# EAGLE design 224_distance_2m (EAGLE 9.6.0)
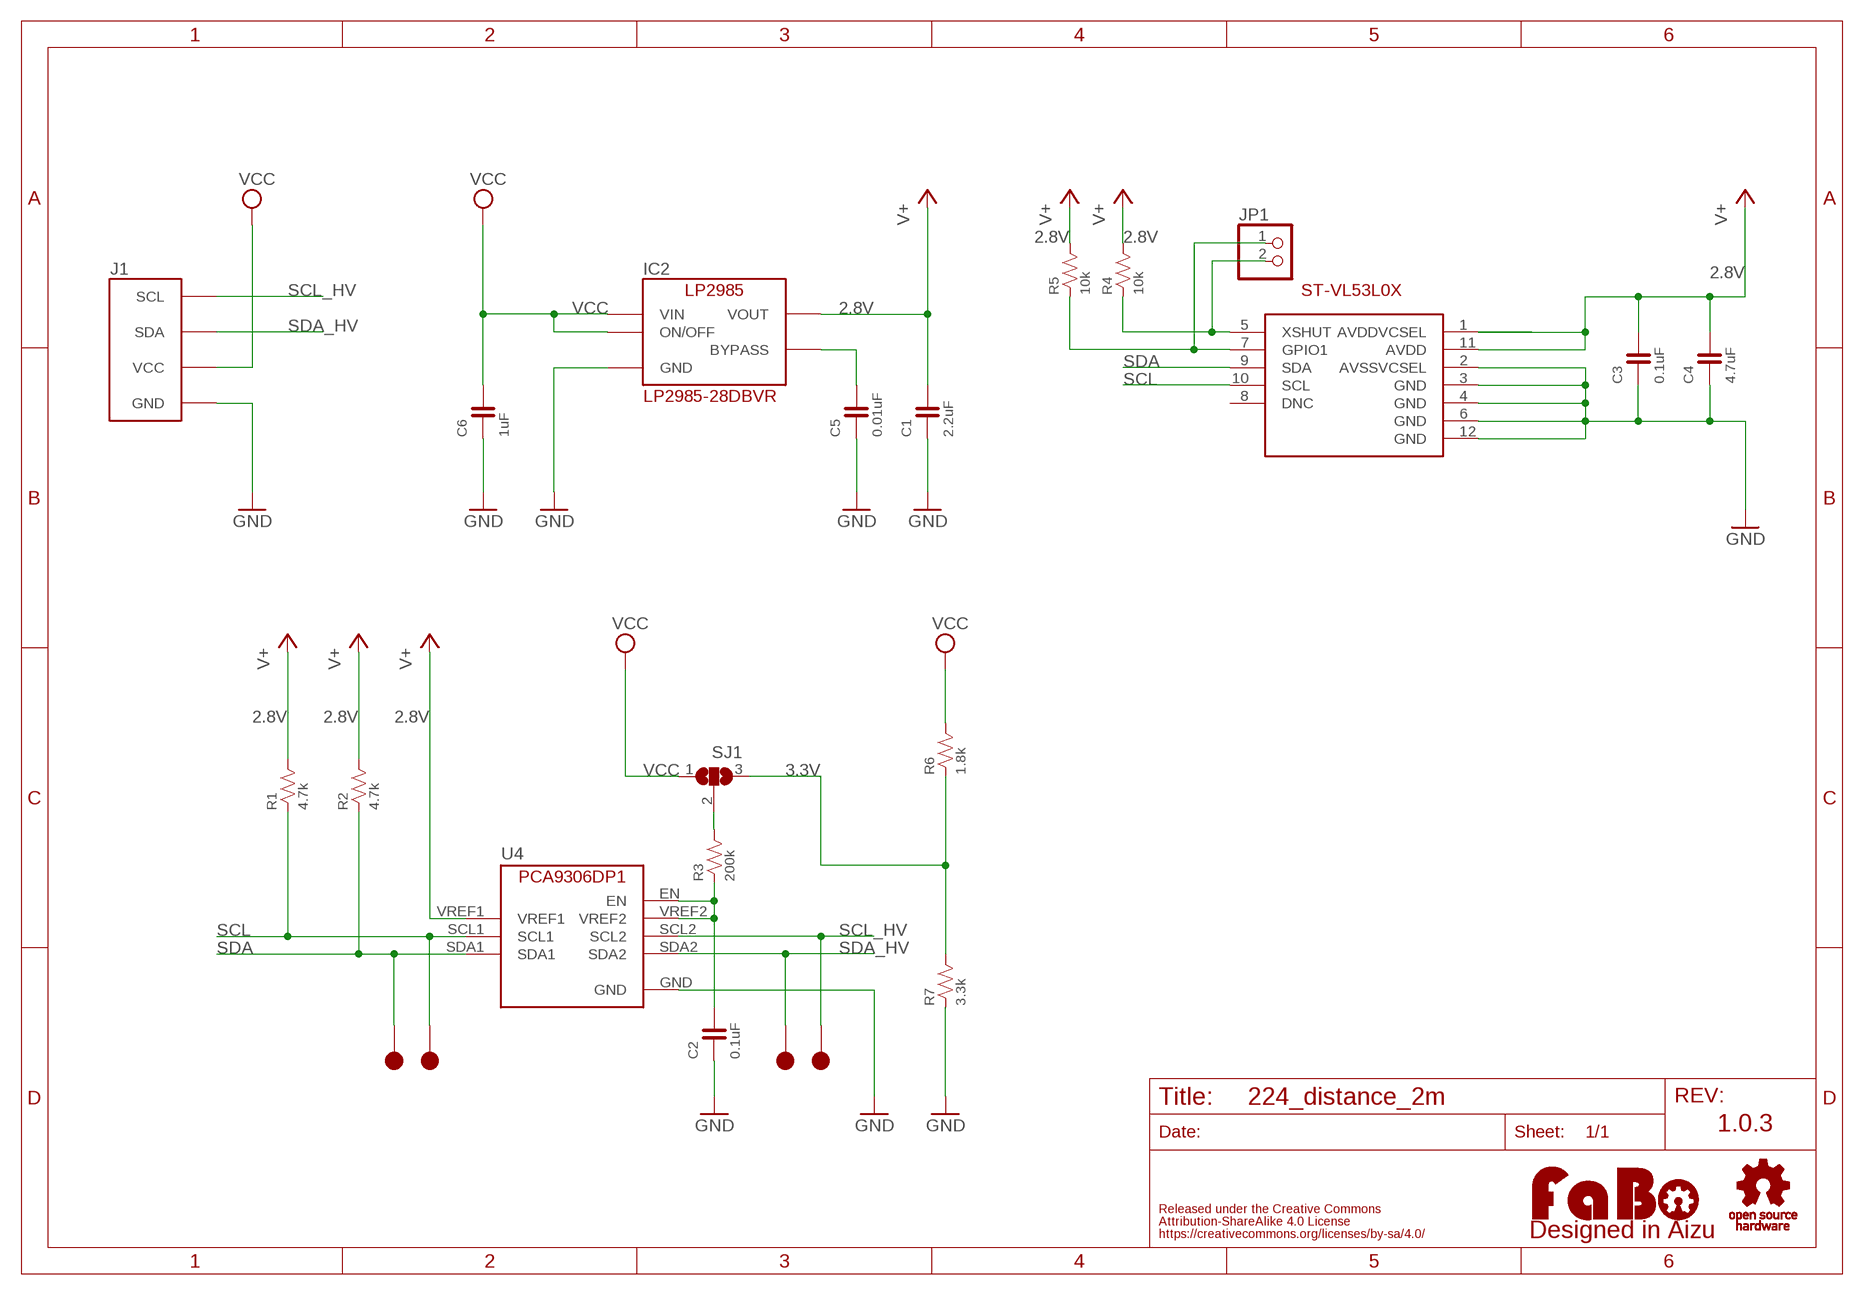
[diagram p0: schematic, sheet 1]

## Parts
C1  2.2uF  CAPACITOR-0603  [0603]
C2  0.1uF  CAPACITOR-0603  [0603]
C3  0.1uF  CAPACITOR-0603  [0603]
C4  4.7uF  CAPACITOR-0603  [0603]
C5  0.01uF  CAPACITOR-0603  [0603]
C6  1uF  CAPACITOR-0603  [0603]
IC2  LP2985-33DBV  [SOT-23-5]
J1  FABO_BRICK_I2C  [FABO_BRICK_I2C]
JP1  PINHD-1X2  [1X02]
LOGO1  LOGO_FABO-M  [LOGO_FABO_M]
R1  4.7k  RESISTOR-0603  [0603]
R2  4.7k  RESISTOR-0603  [0603]
R3  200k  RESISTOR-0603  [0603]
R4  10k  RESISTOR-0603  [0603]
R5  10k  RESISTOR-0603  [0603]
R6  1.8k  RESISTOR-0603  [0603]
R7  3.3k  RESISTOR-0603  [0603]
SJ1  SJ2W  [SJ_2]
TP1  TP-15  [TP-15]
TP2  TP-15  [TP-15]
TP3  TP-15  [TP-15]
TP4  TP-15  [TP-15]
U4  PCA9306DP1  [TSSOP8]
U$2  LOGO_OSHW-M_BOTTOM  [LOGO_OSHW_M_BOTTOM]
VL1  ST-VL53L0XVL53  [ST-VL53L0X]

## Nets
2.8V: C1.2 C3.2 C4.2 IC2.5(VOUT) R1.2 R2.2 R4.2 R5.2 U4.VREF1 VL1.1(AVDDVCSEL) VL1.11(AVDD) ; supply symbol labelled V+
3.3V: R6.1 R7.2 SJ1.3
GND: C1.1 C2.1 C3.1 C4.1 C5.1 C6.1 IC2.2(GND) J1.GND R7.1 U4.GND VL1.2(AVSSVCSEL) VL1.3(GND) VL1.4(GND) VL1.6(GND) VL1.12(GND)
N$1: C2.2 R3.1 U4.EN U4.VREF2
N$2: R3.2 SJ1.2
N$3: C5.2 IC2.4(BYPASS)
N$5: JP1.2 R4.1 VL1.5(XSHUT)
N$6: JP1.1 R5.1 VL1.7(GPIO1)
SCL: R1.1 TP2.1 U4.SCL1 VL1.10(SCL)
SCL_HV: J1.SCL TP4.1 U4.SCL2
SDA: R2.1 TP1.1 U4.SDA1 VL1.9(SDA)
SDA_HV: J1.SDA TP3.1 U4.SDA2
VCC: C6.2 IC2.1(VIN) IC2.3(ON/OFF) J1.VCC R6.2 SJ1.1
Unconnected: VL1.8(DNC)

## Notes on the sheet
- ST-VL53L0X
- LP2985-28DBVR
- 1.0.3

## Library data of the parts
C1-C6 = FaBo-Capacitor:CAPACITOR: CAPACITOR
IC2 = FaBo-Supply:LP2985: LP2985
J1 = FaBo-Template:FABO_BRICK_I2C: FaBo Brick I2C
JP1 = pinhead:PINHD-1X2: PIN HEADER; SPICEPREFIX: B
LOGO1 = component:LOGO_FABO
R1-R7 = FaBo-Resistors:RESISTOR: RESISTOR
SJ1 = jumper:SJ2W: SMD solder JUMPER
TP1-TP4 = FaBo-Supply:TP
U4 = FaBo-LevelTranslator:PCA9306DP1
U$2 = FaBo-etc:LOGO_OSHW
VL1 = FaBo-Mems:ST-VL53L0X

## Board
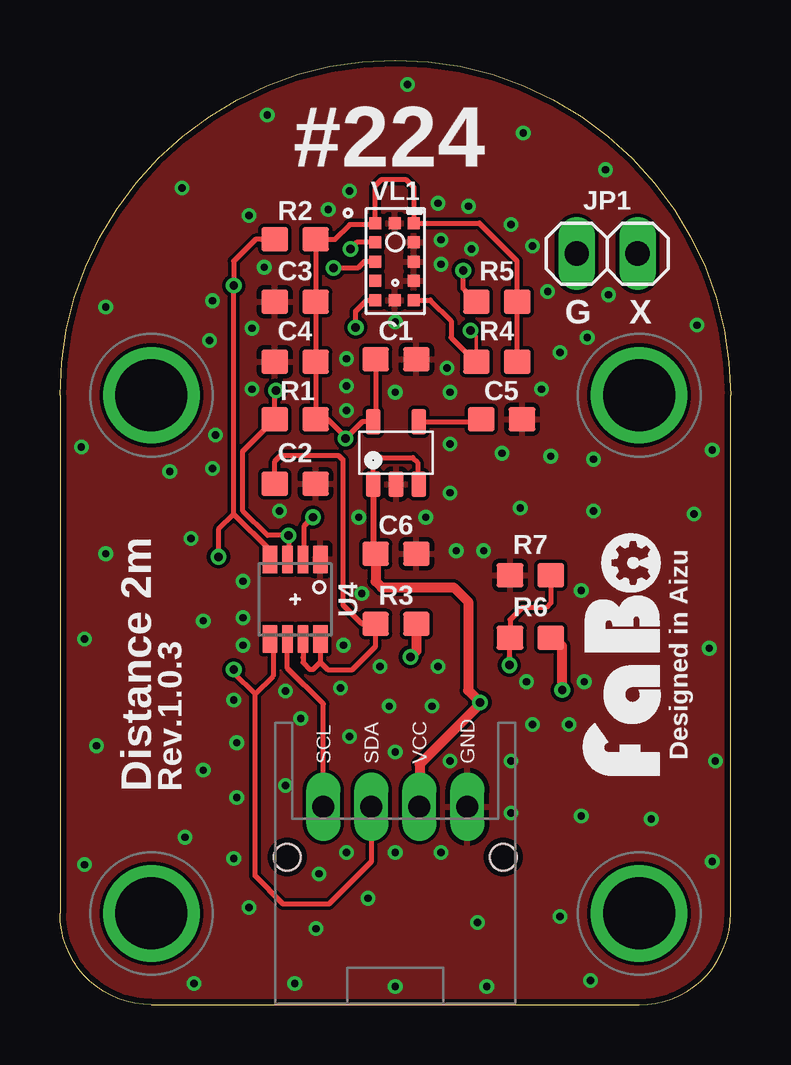
[diagram p1: board, top side]
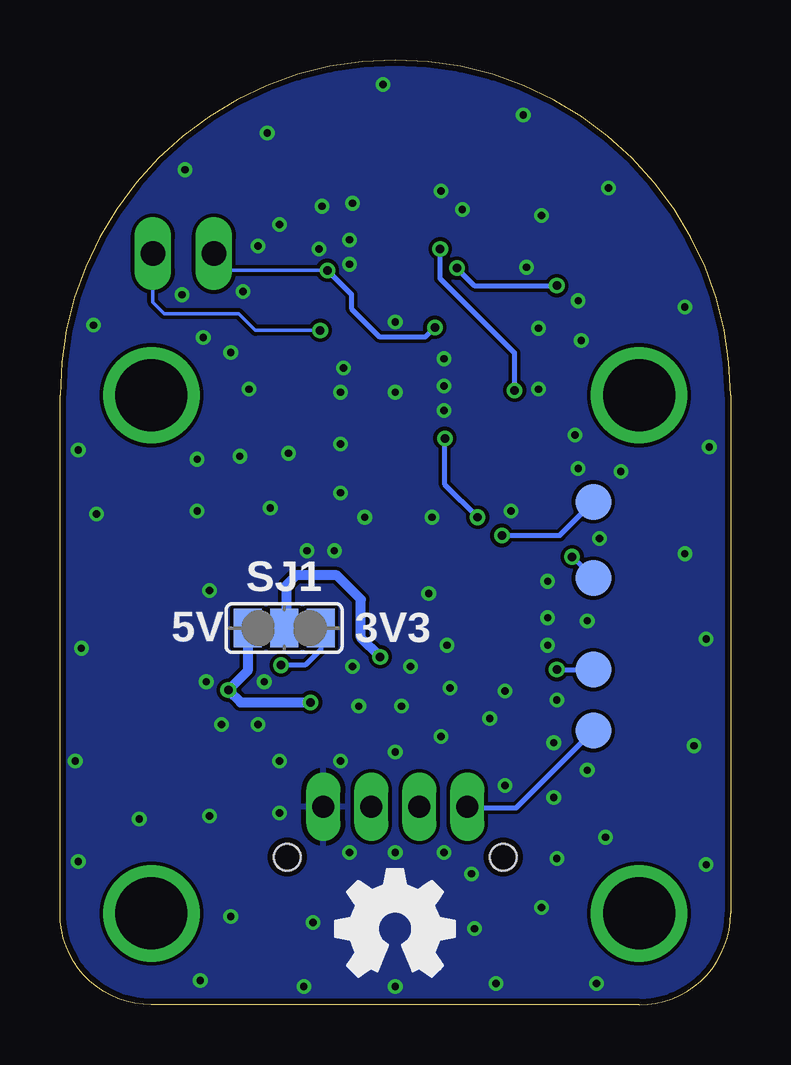
[diagram p2: board, bottom side, seen from below]

Size 27.94 x 39.37 mm. Coordinates in mm from the lower left corner, seen from the top.
Copper layers (1*16): Top 0.035mm / dielectric 1.6mm / Bottom 0.035mm
Design rules "PCBway": minimum track width 6mil, minimum drill 12mil, track to track 6mil, track to pad 6mil, pad to pad 6mil, via to via 6mil, smd to smd 6mil, copper to edge 10mil, drill to drill 10mil, minimum pad ring 10mil, minimum via ring 6mil, stop-mask expansion 2mil, vias tented up to drill 100mil, thermal gap 8mil

### Footprints (pad centres in the part's own frame; a part is rotated, then mirrored left to right if it is on the bottom)
0603 = smd 1.1 x 1: 1 -0.85,0; 2 0.85,0
SOT-23-5 = smd 0.6 x 1.05: 1 -0.95,-1.3; 2 0,-1.3; 3 0.95,-1.3; 4 0.95,1.3; 5 -0.95,1.3
FABO_BRICK_I2C = drill 0.9 pad 1.422 long: GND 3,-10.795; SCL -3,-10.795; SDA -1,-10.795; VCC 1,-10.795 | drill 3 pad 3.81: P$1 -10.16,6.35; P$2 10.16,6.35; P$3 -10.16,-15.24; P$4 10.16,-15.24 | hole 1.1: -4.5,-12.895; 4.5,-12.895
1X02 = drill 1.016 long: 1 -1.27,0; 2 1.27,0
SJ_2 = smd 1.168 x 1.6: 1 -1.524,0; 2 0,0; 3 1.524,0
TP-15 = smd 1.5 x 1.5: 1 0,0
TSSOP8 = smd 0.6 x 1.15: EN -1.05,1.663; GND -1.05,-1.663; SDA1 1.05,-1.663; SDA2 1.05,1.663 | smd 0.45 x 1.15: SCL1 0.325,-1.663; SCL2 0.325,1.663; VREF1 -0.325,-1.663; VREF2 -0.325,1.663
ST-VL53L0X = smd 0.5 x 0.5: 1 0.77,1.58; 2 0.77,0.78; 3 0.77,-0.02; 4 0.77,-0.82; 5 0.77,-1.62; 6 -0.03,-1.62; 7 -0.83,-1.62; 8 -0.83,-0.82; 9 -0.83,-0.02; 10 -0.83,0.78; 11 -0.83,1.58; 12 -0.03,1.58

### Placement (x,y rotation side)
C1  14,26.9 180 top
C2  9.8,21.71 180 top
C3  9.8,29.3 0 top
C4  9.8,26.8 0 top
C5  18.4,24.4 180 top
C6  14,18.8 180 top
IC2  14,23 0 top
J1  13.97,19.05 0 top
JP1  22.8,31.3 0 top
LOGO1  25.4,14.61 90 top
R1  9.8,24.4 0 top
R2  9.8,31.9 0 top
R3  14,15.88 0 top
R4  18.2,26.8 0 top
R5  18.2,29.3 0 top
R6  19.6,15.3 0 top
R7  19.6,17.9 0 top
SJ1  18.6,15.7 0 bottom
TP1  5.71,17.78 0 bottom
TP2  5.71,20.95 0 bottom
TP3  5.71,13.97 0 bottom
TP4  5.71,11.43 0 bottom
U4  9.8,16.9 180 top
U$2  13.97,3.17 0 top
VL1  13.97,30.99 0 top

### Tracks (layer width: path | path; a pad name or v marks a point on that pad's centre or on a via)
2.8V  (via drill 0.35)
  Top 0.152: VL1.11 13.08,32.51
  Top 0.2: 12.06,32.51 11.45,31.9 R2.2 C3.2 C4.2 R1.2 | IC2.5 12.95,24.4 13.15,24.6 C1.2
  Top 0.203: 13.08,32.51 12.06,32.51 | VL1.11 13.14,34.14 13.4,34.4 14.4,34.4 14.74,34.06 VL1.1 17.47,32.57 19.05,30.99 R5.2 R4.2 | U4.VREF1 10.16,18.6 10.16,19.94 v10.54,20.32 | IC2.5 12.6,24.3 11.93,23.63 | 11.93,23.63 v11.9,23.6 | R1.2 11.16,24.4 11.93,23.63
  Bottom 0.203: v10.54,20.32 11.9,21.68 v11.9,23.6
3.3V  (via drill 0.35)
  Top 0.203: R7.2 20.45,16.75 20.25,16.55 19.25,16.55 18.75,16.05 R6.1 18.73,15.28 v18.73,14.15
  Bottom 0.203: SJ1.3 17.08,14.8 17.73,14.15 v18.73,14.15
GND  (via drill 0.3)
  other vias: 13.97,28.45 15.88,31.88 15.88,30.86 17.14,31.5 15.75,33.4 17.02,33.27 18.8,32.51 20.32,29.72 19.68,31.62 12.06,33.91 11.18,33.15 8.51,30.73 11.94,26.92 11.94,24.77 11.94,25.78 13.97,25.53 16.26,25.53 16.13,26.54 20.07,25.65 20.83,27.18 22.86,29.59 21.97,27.81 7.87,32.89 6.35,29.34 8,28.19 8,25.65 6.48,23.75 16.26,23.37 18.41,22.99 20.45,22.86 22.23,22.73 15.24,20.32 16.26,21.34 6.35,22.35 6.22,27.69 12.45,20.32 12.57,17.14 7.62,17.65 7.62,16.13 5.97,16 5.46,19.43 4.57,22.23 9.14,20.57 11.81,14.99 13.34,14.1 15.75,14.1 16.51,18.92 17.65,18.92 19.18,20.7 22.23,20.57 21.72,17.27 19.43,13.46 19.68,11.68 21.84,13.46 21.21,11.68 18.8,8 18.8,10.16 16.26,10.16 15.49,12.45 11.68,13.21 9.4,13.08 10.03,11.94 12.06,11.18 13.97,10.54 13.72,12.45 7.62,14.99 7.24,12.7 7.37,10.92 9.4,9.14 7.37,8.64 5.97,9.78 7.24,6.1 5.21,6.99 11.94,6.35 10.79,5.46 13.97,6.35 15.88,6.35 7.87,4.06 10.67,3.17 12.83,4.45 20.83,3.68 22.1,1.02 13.97,0.76 17.78,0.76 9.78,0.89 5.59,0.89 1.02,5.84 27.18,5.97 21.72,7.87 24.64,7.75 17.4,3.43 1.02,15.24 27.05,14.86 27.3,10.16 1.52,10.79 0.89,23.24 27.18,23.11 26.42,20.45 1.91,18.8 26.54,28.32 1.91,29.08 5.08,34.04 14.48,38.35 22.73,34.8 19.3,36.32 8.64,37.08
  pour Bottom (isolate 0.152): 0,0 27.94,0 27.94,39.37 0,39.37
  pour Top (isolate 0.152): 0,0 27.94,0 27.94,39.37 0,39.37
N$1
  Top 0.2: U4.VREF2 10.12,14.48 | 13.15,14.94 R3.1 | U4.EN 10.85,14.48
  Top 0.203: C2.2 8.95,22.65 9.2,22.9 11.6,22.9 11.8,22.7 11.8,16.65 12.58,15.88 R3.1 | 10.12,14.48 10.12,14.26 10.41,13.97 10.54,13.97 10.85,14.28 | 10.85,14.48 10.85,14.28 | 10.85,14.28 11.16,13.97 12.18,13.97 13.15,14.94
N$2  (via drill 0.35)
  Top 0.406: R3.2 14.85,14.75 v14.6,14.5
  Bottom 0.152: SJ1.2 18.5,15.8
  Bottom 0.406: v14.6,14.5 15.4,15.3 15.4,16.9 16.4,17.9 18.1,17.9 18.5,17.5 18.5,15.8
N$3
  Top 0.2: IC2.4 17.45,24.3 C5.2
N$5  (via drill 0.35)
  Top 0.152: R4.1 17.35,27.85 v17.1,28.1
  Top 0.203: VL1.5 15.43,29.37 16.3,28.5 16.3,27.8 17.3,26.8 R4.1
  Bottom 0.152: JP1.2 24.07,29.27 23.6,28.8 20.5,28.8 19.8,28.1 v17.1,28.1
N$6  (via drill 0.35)
  Top 0.203: R5.1 16.8,29.85 v16.8,30.6 | v12.32,28.23 12.32,28.91 12.78,29.37 VL1.7
  Bottom 0.152: JP1.1 20.83,30.6 v16.8,30.6
  Bottom 0.203: v16.8,30.6 15.8,29.6 15.8,29.01 14.64,27.85 12.7,27.85 v12.32,28.23
SCL  (via drill 0.35)
  Top 0.203: U4.SCL1 9.53,18.61 v9.53,19.56 8.64,19.56 7.62,20.57 7.62,23.07 R1.1 8.95,25.55 v9,25.6 | VL1.10 12.37,31.77 v12.1,31.5
  Bottom 0.203: v9,25.6 9,27.16 12.1,30.26 v12.1,31.5 | v9.53,19.56 7.11,19.56 TP2.1
SCL_HV
  Top 0.2: J1.SCL 10.97,12.54 9.47,14.03 U4.SCL2
  Bottom 0.2: TP4.1 8.95,8.2 10.91,8.2 J1.SCL
SDA  (via drill 0.35)
  Top 0.2: R2.1 8.4,31.9
  Top 0.203: VL1.9 12.67,30.97 12.4,30.7 v11.4,30.7 | 8.4,31.9 8.15,31.9 7.24,30.99 v7.24,29.97 7.24,20.45 | 7.24,20.45 6.6,19.81 v6.6,18.67 | U4.SDA1 8.75,18.94 7.24,20.45
  Bottom 0.2: v6.6,18.67 TP1.1
  Bottom 0.203: v11.4,30.7 10.67,29.97 v7.24,29.97
SDA_HV  (via drill 0.35)
  Top 0.2: J1.SDA 12.97,5.97 11.2,4.2 9.3,4.2 8.13,5.37 8.13,12.95 | U4.SDA2 8.88,15.11 8.88,13.7
  Top 0.203: 8.88,13.7 8.13,12.95 7.24,13.84 v7.24,13.97
  Bottom 0.2: v7.24,13.97 TP3.1
VCC  (via drill 0.35)
  Top 0.203: IC2.1 13.05,22.45 13.4,22.8 14.7,22.8 14.9,22.6 14.9,21.75 IC2.3
  Top 0.254: IC2.1 13.05,18.9 C6.2
  Top 0.406: C6.2 13.15,17.65 13.4,17.4 16.4,17.4 17,16.8 17,13.1 v17.5,12.6 17.5,12.55 14.99,10.03 14.99,8.27 J1.VCC | v20.93,13.12 20.93,14.95 20.58,15.3 R6.2
  Bottom 0.406: v17.5,12.6 v17.51,12.61 20.42,12.61 v20.93,13.12 20.12,13.92 SJ1.1

### Text on the board
tPlace: #224 | G | X | Designed in Aizu | Distance 2m | Rev.1.0.3
bPlace: 3V3 | 5V